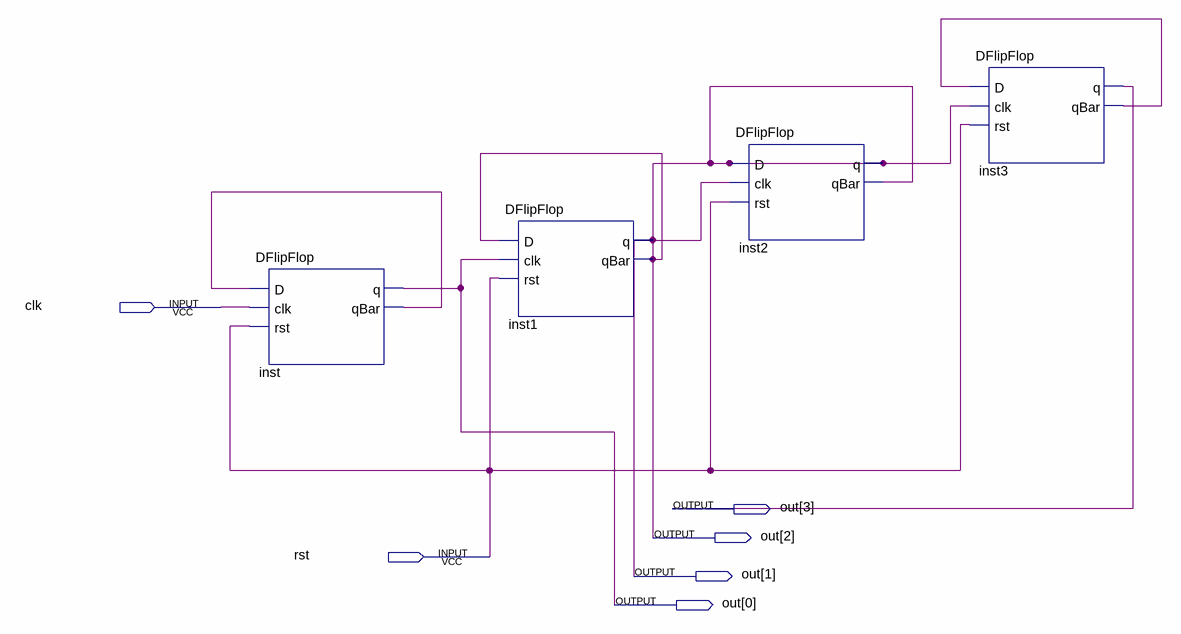
[diagram p0: schematic sheet]
// Quartus schematic counter.bdf as structural Verilog: 4 symbols, 6 pins
module counter (
  input  clk,
  input  rst,
  output [3:0] out
);

  wire inst3_qbar, inst_qbar;

  DFlipFlop inst (.D(inst_qbar), .clk(clk), .rst(rst), .q(out[0]), .qBar(inst_qbar));
  DFlipFlop inst1 (.D(out[2]), .clk(out[0]), .rst(rst), .q(out[2]), .qBar(out[2]));
  DFlipFlop inst2 (.D(out[2]), .clk(out[2]), .rst(rst), .q(out[2]), .qBar(out[2]));
  DFlipFlop inst3 (.D(inst3_qbar), .clk(out[2]), .rst(rst), .q(out[3]), .qBar(inst3_qbar));

  assign out[1] = out[2];
endmodule
